# Altium schematic sheet L9963E.SchDoc
size A3; SheetNumber: 3; SheetTotal: 5
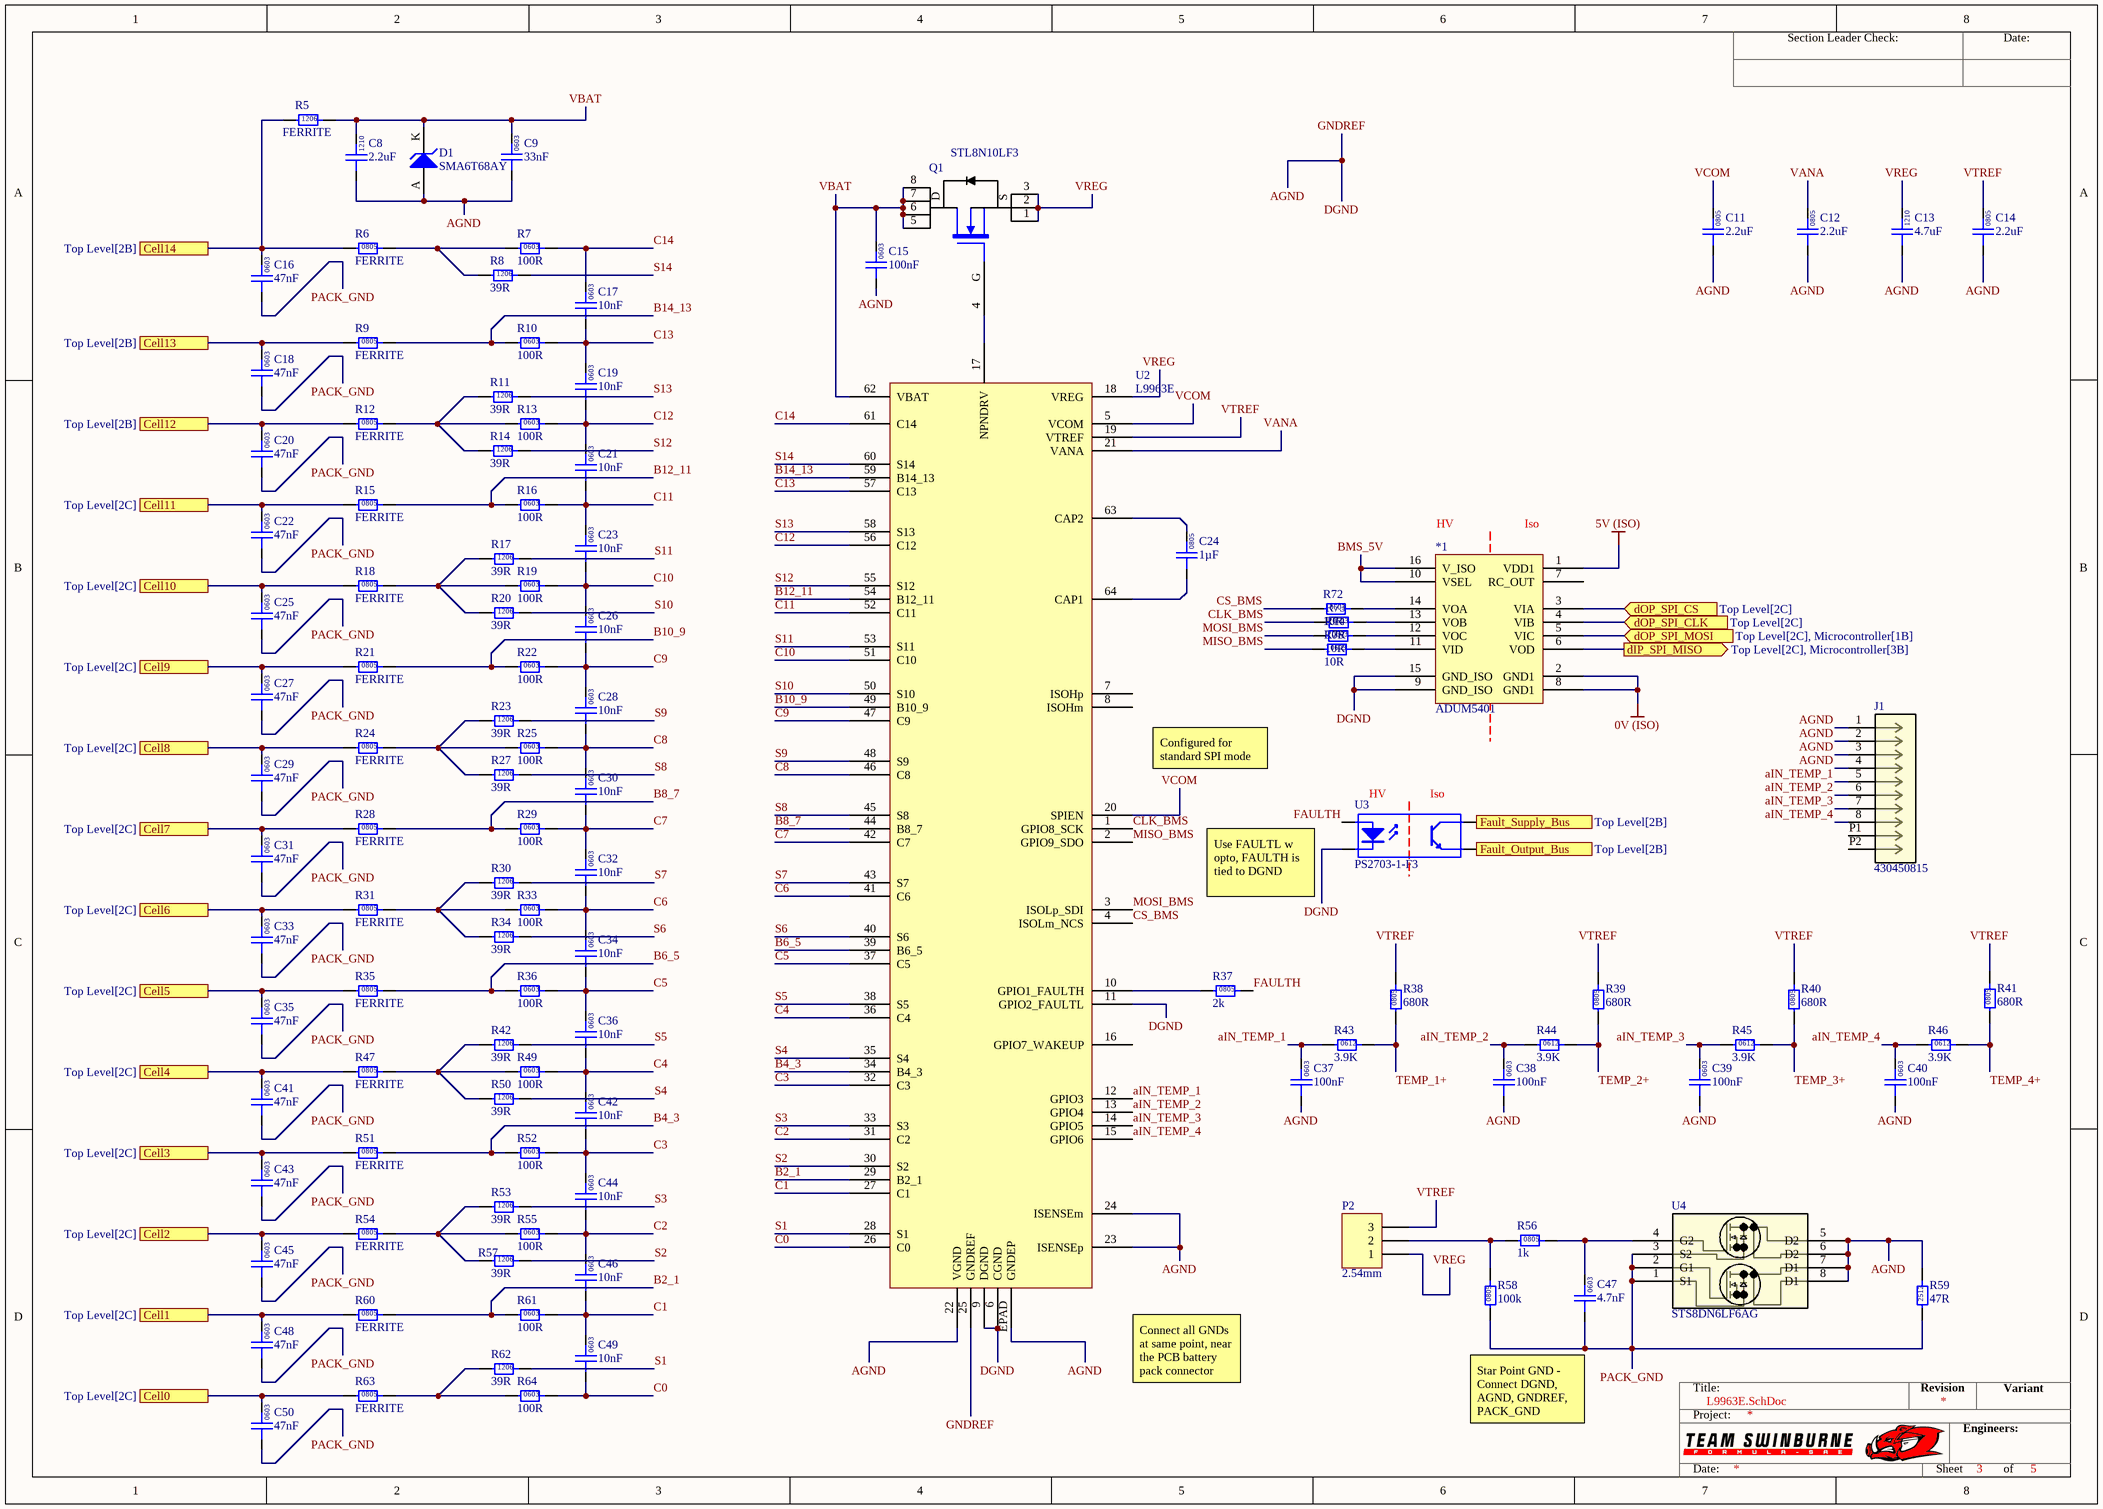
[diagram p0: L9963E.SchDoc]

## Parts
*1  ADUM5401  [AD 16-SOIC]
C8  2.2uF  [1210]
C9  33nF  [0603]
C11  2.2uF  [0805]
C12  2.2uF  [0805]
C13  4.7uF  [1210]
C14  2.2uF  [0805]
C15  100nF  [0603]
C16  47nF  [0603]
C17  10nF  [0603]
C18  47nF  [0603]
C19  10nF  [0603]
C20  47nF  [0603]
C21  10nF  [0603]
C22  47nF  [0603]
C23  10nF  [0603]
C24  1µF  [0805]
C25  47nF  [0603]
C26  10nF  [0603]
C27  47nF  [0603]
C28  10nF  [0603]
C29  47nF  [0603]
C30  10nF  [0603]
C31  47nF  [0603]
C32  10nF  [0603]
C33  47nF  [0603]
C34  10nF  [0603]
C35  47nF  [0603]
C36  10nF  [0603]
C37  100nF  [0603]
C38  100nF  [0603]
C39  100nF  [0603]
C40  100nF  [0603]
C41  47nF  [0603]
C42  10nF  [0603]
C43  47nF  [0603]
C44  10nF  [0603]
C45  47nF  [0603]
C46  10nF  [0603]
C47  4.7nF  [0603]
C48  47nF  [0603]
C49  10nF  [0603]
C50  47nF  [0603]
D1  SMA6T68AY  [ST SMB DIODE]
J1  430450815  [430450815]
P2  2.54mm  [TH 2.54mm Header 1x3]
Q1  STL8N10LF3  [TRANS_STL60P4LLF6]
R5  FERRITE  [1206]
R6  FERRITE  [0805]
R7  100R  [0603]
R8  39R  [1206]
R9  FERRITE  [0805]
R10  100R  [0603]
R11  39R  [1206]
R12  FERRITE  [0805]
R13  100R  [0603]
R14  39R  [1206]
R15  FERRITE  [0805]
R16  100R  [0603]
R17  39R  [1206]
R18  FERRITE  [0805]
R19  100R  [0603]
R20  39R  [1206]
R21  FERRITE  [0805]
R22  100R  [0603]
R23  39R  [1206]
R24  FERRITE  [0805]
R25  100R  [0603]
R27  39R  [1206]
R28  FERRITE  [0805]
R29  100R  [0603]
R30  39R  [1206]
R31  FERRITE  [0805]
R33  100R  [0603]
R34  39R  [1206]
R35  FERRITE  [0805]
R36  100R  [0603]
R37  2k  [0805]
R38  680R  [0805]
R39  680R  [0805]
R40  680R  [0805]
R41  680R  [0805]
R42  39R  [1206]
R43  3.9K  [0612]
R44  3.9K  [0612]
R45  3.9K  [0612]
R46  3.9K  [0612]
R47  FERRITE  [0805]
R49  100R  [0603]
R50  39R  [1206]
R51  FERRITE  [0805]
R52  100R  [0603]
R53  39R  [1206]
R54  FERRITE  [0805]
R55  100R  [0603]
R56  1k  [0805]
R57  39R  [1206]
R58  100k  [0805]
R59  47R  [2512]
R60  FERRITE  [0805]
R61  100R  [0603]
R62  39R  [1206]
R63  FERRITE  [0805]
R64  100R  [0603]
R72  10R  [0603]
R73  10R  [0603]
R74  10R  [0603]
R75  10R  [0603]
U2  L9963E  [TQFP64_L9963E_STM]
U3  PS2703-1-F3  [4-SOP]
U4  STS8DN6LF6AG  [SO-8_STM-M]

## Ports
Cell0 (see Top Level[2C]), Cell1 (see Top Level[2C]), Cell2 (see Top Level[2C]), Cell3 (see Top Level[2C]), Cell4 (see Top Level[2C]), Cell5 (see Top Level[2C]), Cell6 (see Top Level[2C]), Cell7 (see Top Level[2C]), Cell8 (see Top Level[2C]), Cell9 (see Top Level[2C]), Cell10 (see Top Level[2C]), Cell11 (see Top Level[2C]), Cell12 (see Top Level[2B]), Cell13 (see Top Level[2B]), Cell14 (see Top Level[2B]), dIP_SPI_MISO (out, see Top Level[2C], Microcontroller[3B]), dOP_SPI_CLK (in, see Top Level[2C]), dOP_SPI_CS (in, see Top Level[2C]), dOP_SPI_MOSI (in, see Top Level[2C], Microcontroller[1B]), Fault_Output_Bus (see Top Level[2B]), Fault_Supply_Bus (see Top Level[2B])

## Nets
0V (ISO): *1.2(GND1) *1.8(GND1)
5V (ISO): *1.1(VDD1)
AGND: *1.9(GND_ISO) *1.15(GND_ISO) C8.1 C9.1 C11.1 C12.1 C13.1 C14.1 C15.1 C37.1 C38.1 C39.1 C40.1 D1.A J1.1 J1.2 J1.3 J1.4 R59.2 U2.6(CGND) U2.9(DGND) U2.11(GPIO2_FAULTL) U2.22(VGND) U2.23(ISENSEp) U2.24(ISENSEm) U2.25(GNDREF) U2.EPAD(GNDEP) U3.2(K) U4.5(D2) U4.6(D2) U4.7(D1) U4.8(D1)  [also labelled DGND, GNDREF]
aIN_TEMP_1: C37.2 J1.5 R43.1 U2.12(GPIO3)
aIN_TEMP_2: C38.2 J1.6 R44.1 U2.13(GPIO4)
aIN_TEMP_3: C39.2 J1.7 R45.1 U2.14(GPIO5)
aIN_TEMP_4: C40.2 J1.8 R46.1 U2.15(GPIO6)
B2_1: R60.2 R61.1 U2.29(B2_1)
B4_3: R51.2 R52.1 U2.34(B4_3)
B6_5: R35.2 R36.1 U2.39(B6_5)
B8_7: R28.2 R29.1 U2.44(B8_7)
B10_9: R21.2 R22.1 U2.49(B10_9)
B12_11: R15.2 R16.1 U2.54(B12_11)
B14_13: R9.2 R10.1 U2.59(B14_13)
BMS_5V: *1.10(VSEL) *1.16(V_ISO)
C0: C49.1 R64.2 U2.26(C0)
C1: C46.1 C49.2 R61.2 U2.27(C1)
C2: C44.1 C46.2 R55.2 U2.31(C2)
C3: C42.1 C44.2 R52.2 U2.32(C3)
C4: C36.1 C42.2 R49.2 U2.36(C4)
C5: C34.1 C36.2 R36.2 U2.37(C5)
C6: C32.1 C34.2 R33.2 U2.41(C6)
C7: C30.1 C32.2 R29.2 U2.42(C7)
C8: C28.1 C30.2 R25.2 U2.46(C8)
C9: C26.1 C28.2 R22.2 U2.47(C9)
C10: C23.1 C26.2 R19.2 U2.51(C10)
C11: C21.1 C23.2 R16.2 U2.52(C11)
C12: C19.1 C21.2 R13.2 U2.56(C12)
C13: C17.1 C19.2 R10.2 U2.57(C13)
C14: C17.2 R7.2 U2.61(C14)
Cell0: C50.2 R63.1 ; port Cell0
Cell1: C48.2 R60.1 ; port Cell1
Cell2: C45.2 R54.1 ; port Cell2
Cell3: C43.2 R51.1 ; port Cell3
Cell4: C41.2 R47.1 ; port Cell4
Cell5: C35.2 R35.1 ; port Cell5
Cell6: C33.2 R31.1 ; port Cell6
Cell7: C31.2 R28.1 ; port Cell7
Cell8: C29.2 R24.1 ; port Cell8
Cell9: C27.2 R21.1 ; port Cell9
Cell10: C25.2 R18.1 ; port Cell10
Cell11: C22.2 R15.1 ; port Cell11
Cell12: C20.2 R12.1 ; port Cell12
Cell13: C18.2 R9.1 ; port Cell13
Cell14: C16.2 R5.1 R6.1 ; port Cell14
CLK_BMS: R73.1 U2.1(GPIO8_SCK)
CS_BMS: R72.1 U2.4(ISOLm_NCS)
dIP_SPI_MISO: *1.6(VOD) ; port dIP_SPI_MISO
dOP_SPI_CLK: *1.4(VIB) ; port dOP_SPI_CLK
dOP_SPI_CS: *1.3(VIA) ; port dOP_SPI_CS
dOP_SPI_MOSI: *1.5(VIC) ; port dOP_SPI_MOSI
Fault_Output_Bus: U3.3(E) ; port Fault_Output_Bus
Fault_Supply_Bus: U3.4(C) ; port Fault_Supply_Bus
FAULTH: R37.2 U3.1(A)
MISO_BMS: R75.1 U2.2(GPIO9_SDO)
MOSI_BMS: R74.1 U2.3(ISOLp_SDI)
PACK_GND: C16.1 C18.1 C20.1 C22.1 C25.1 C27.1 C29.1 C31.1 C33.1 C35.1 C41.1 C43.1 C45.1 C47.1 C48.1 C50.1 R58.1 R59.1 U4.1(S1) U4.2(G1) U4.3(S2)
S1: R62.2 U2.28(S1)
S2: R57.2 U2.30(S2)
S3: R53.2 U2.33(S3)
S4: R50.2 U2.35(S4)
S5: R42.2 U2.38(S5)
S6: R34.2 U2.40(S6)
S7: R30.2 U2.43(S7)
S8: R27.2 U2.45(S8)
S9: R23.2 U2.48(S9)
S10: R20.2 U2.50(S10)
S11: R17.2 U2.53(S11)
S12: R14.2 U2.55(S12)
S13: R11.2 U2.58(S13)
S14: R8.2 U2.60(S14)
TEMP_1+: R38.1 R43.2
TEMP_2+: R39.1 R44.2
TEMP_3+: R40.1 R45.2
TEMP_4+: R41.1 R46.2
VANA: C12.2 U2.21(VANA)
VBAT: C8.2 C9.2 C15.2 D1.K Q1.5(D) Q1.6(D) Q1.7(D) Q1.8(D) R5.2 U2.62(VBAT)
VCOM: C11.2 U2.5(VCOM) U2.20(SPIEN)
VREG: C13.2 P2.1 Q1.1(S) Q1.2(S) Q1.3(S) U2.18(VREG)
VTREF: C14.2 P2.3 R38.2 R39.2 R40.2 R41.2 U2.19(VTREF)
Net*1_11: *1.11(VID) R75.2
Net*1_12: *1.12(VOC) R74.2
Net*1_13: *1.13(VOB) R73.2
Net*1_14: *1.14(VOA) R72.2
NetC24_1: C24.1 U2.64(CAP1)
NetC24_2: C24.2 U2.63(CAP2)
NetC47_2: C47.2 R56.2 U4.4(G2)
NetP2_2: P2.2 R56.1 R58.2
NetQ1_4: Q1.4(G) U2.17(NPNDRV)
NetR6_2: R6.2 R7.1 R8.1
NetR11_1: R11.1 R12.2 R13.1 R14.1
NetR17_1: R17.1 R18.2 R19.1 R20.1
NetR23_1: R23.1 R24.2 R25.1 R27.1
NetR30_1: R30.1 R31.2 R33.1 R34.1
NetR37_1: R37.1 U2.10(GPIO1_FAULTH)
NetR42_1: R42.1 R47.2 R49.1 R50.1
NetR53_1: R53.1 R54.2 R55.1 R57.1
NetR62_1: R62.1 R63.2 R64.1

Not connected (* = marked no-connect by the designer): *1 7(RC_OUT); J1 P1 P2; U2 7(ISOHp) 8(ISOHm) 16(GPIO7_WAKEUP)

## Notes on the sheet
- (near *1) HV
- (near *1) Iso
- Configured for standard SPI mode
- (near U3) HV
- (near U3) Iso
- (near U3) Use FAULTL w opto, FAULTH is tied to DGND
- (near U2) Connect all GNDs at same point, near the PCB battery pack connector
- Star Point GND - Connect DGND, AGND, GNDREF, PACK_GND
- Section Leader Check:
- Date:
- Title:
- Revision
- Variant
- Project:
- Engineers:
- Sheet
- of
- (in symbol 3430B2F3K9TDF) 0612
- (in symbol BLM31KN102SH1L) 1206
- (in symbol C1210X475K101T) 1210
- (in symbol CGA3E2X7R2A472K080AA) 0603
- (in symbol CL10B104KC8NNNC) 0603
- (in symbol CL10B333KC8WPNC) 0603
- (in symbol CL32B225KCJSNNE) 1210
- (in symbol CRCW120639R0FKEAHP) 1206
- (in symbol CRCW251247R0FKEG) 2512
- (in symbol GCJ188R92A473KA01D) 0603
- (in symbol GCM21BR71H105KA03L) 0805
- (in symbol GCM188L81H103KA03D) 0603
- (in symbol GRM21BR71E225KE11L) 0805
- (in symbol MPZ2012S102ATD25) 0805
- (in symbol RC0603FR-0710RL) 0603
- (in symbol RC0805FR071KL) 0805
- (in symbol RC0805FR072KL) 0805
- (in symbol RC0805FR07100KL) 0805
- (in symbol RCS0805680RFKEA) 0805

## Library data of the parts
*1 = ADUM5401: Quad Channel 2.5kV Digital Isolator with isoPower; Manufacturer: Analogue Devices; Complex IC: 0; Part Number: ADUM5401
C8 = CL32B225KCJSNNE: Manufacturer: Samsung Electro-Mechanics; Rated Voltage: 100V; Tolerance: ±10%; Material: MLCC; Temperature Rating: X7R; Part Number: CL32B225KCJSNNE; Value: 2.2uF; Digikey Part Number: 1276-3362-6-ND
C9 = CL10B333KC8WPNC: Manufacturer: Samsung Electro-Mechanics; Rated Voltage: 100V; Tolerance: ±10%; Material: MLCC; Temperature Rating: X7R; Part Number: CL10B333KC8WPNC; Value: 33nF; Digikey Part Number: 1276-CL10B333KC8WPNCDKR-ND
C11 C12 C14 = GRM21BR71E225KE11L: Manufacturer: Murata Electronics; Rated Voltage: 25V; Tolerance: ±10%; Material: MLCC; Temperature Rating: X7R; Part Number: GRM21BR71E225KE11L; Value: 2.2uF; Digikey Part Number: 490-14467-2-ND
C13 = C1210X475K101T: Manufacturer: Holy Stone Enterprise Co., Ltd.; Rated Voltage: 100V; Tolerance: ±10%; Material: MLCC; Temperature Rating: X7R; Part Number: C1210X475K101T; Value: 4.7uF; Digikey Part Number: 4587-C1210X475K101TDKR-ND
C15 C37-C40 = CL10B104KC8NNNC: Manufacturer: Samsung Electro-Mechanics; Rated Voltage: 100V; Tolerance: ±10%; Material: MLCC; Temperature Rating: X7R; Part Number: CL10B104KC8NNNC; Value: 100nF; Digikey Part Number: 1276-6807-6-ND
C16 C18 C20 C22 C25 C27 C29 C31 C33 C35 C41 C43 C45 C48 C50 = GCJ188R92A473KA01D: Manufacturer: Murata Electronics; Rated Voltage: 100V; Tolerance: ±10%; Material: MLCC; Temperature Rating: X8R; Part Number: GCJ188R92A473KA01D; Value: 47nF; Digikey Part Number: 490-16473-1-ND
C17 C19 C21 C23 C26 C28 C30 C32 C34 C36 C42 C44 C46 C49 = GCM188L81H103KA03D: Manufacturer: muRata; Rated Voltage: 50V; Tolerance: ±10%; Material: MLCC; Temperature Rating: X8L; Part Number: GCM188L81H103KA03D; Value: 10nF; Digikey Part Number: 490-GCM188L81H103KA03DCT-ND
C24 = GCM21BR71H105KA03L: Manufacturer: muRata; Rated Voltage: 50V; Tolerance: ±10%; Material: MLCC; Temperature Rating: X7R; Part Number: GCM21BR71H105KA03L; Value: 1µF; Digikey Part Number: 490-10675-1-ND
C47 = CGA3E2X7R2A472K080AA: Manufacturer: TDK Corporation; Rated Voltage: 100V; Tolerance: ±10%; Material: MLCC; Temperature Rating: X7R; Part Number: CGA3E2X7R2A472K080AA; Value: 4.7nF; Digikey Part Number: 445-5810-6-ND
D1 = SMA6T68AY: Manufacturer: STMicroelectronics; Breakdown Voltage: 121V; Rated Power: 600W; Part Number: SMA6T68AY
J1 = 430450815: No Description Available; Mfr_Name: Molex Connector Corporation; Positions: 8; Pitch: 3.0mm; Angle: 90; Contact: Gold; RefDes: RefDes; Type: Type; Part Number: 430450815; Row Spacing: 3.0mm; Flange: No; Digikey Part Number: WM7067DKR-ND; Digikey Link: https://www.digikey.com/en/products/detail/molex/0430450815/3044333
P2 = TH 2.54mm Header 1x3: Positions: 3; Angle: 0; Flange: No; Contact: NA; Part Number: TH 2.54mm Header 1x3; Pitch: 2.54mm; Row Spacing: 2.54mm
Q1 = STL8N10LF3: N-Channel 100 V 20A (Tc) 4.3W (Ta), 70W (Tc) Surface Mount PowerFlat™ (5x6); Manufacturer: STMicroelectronics; Published: 24-Mar-1999; LatestRevisionDate: 29-May-2009; LatestRevisionNote: IPC-7351 Footprint Added.; PackageVersion: Sep-2000; PackageReference: SOT-343; Publisher: Altium Limited; PackageDescription: 4-Pin SOT-343 Package 1.3 mm Pitch, 2.1 mm Lead Span; Part Number: STL8N10LF3; Type: N-channel; Rated Power: 70W; Digikey Part Number: 497-13652-6-ND
R5 = BLM31KN102SH1L: Manufacturer: Murata Electronics; Value: 1K; Part Number: BLM31KN102SH1L; Rated Power: Ferrite; Digikey Part Number: 490-16520-6-ND
R6 R9 R12 R15 R18 R21 R24 R28 R31 R35 R47 R51 R54 R60 R63 = MPZ2012S102ATD25: Manufacturer: TDK; Value: 1K; Part Number: MPZ2012S102ATD25; Rated Power: Ferrite
R7 R10 R13 R16 R19 R22 R25 R29 R33 R36 R49 R52 R55 R61 R64 = RC0603FR-0710RL: Manufacturer: YAGEO; Value: 10R; Tolerance: 0.01; Rated Power: 0.1W; Part Number: RC0603FR-0710RL; Material: FR-07; Digikey Part Number: 311-10.0HRCT-ND
R8 R11 R14 R17 R20 R23 R27 R30 R34 R42 R50 R53 R57 R62 = CRCW120639R0FKEAHP: Manufacturer: Vishay Dale; Tolerance: 0.01; Rated Power: 0.75W; Part Number: CRCW120639R0FKEAHP; Value: 39R; Digikey Part Number: 541-39.0UCT-ND
R37 = RC0805FR072KL: Manufacturer: YAGEO; Tolerance: 0.01; Rated Power: 0.125W; Part Number: RC0805FR072KL; Value: 2k; Material: FR-07; Digikey Part Number: 311-2.00KCRCT-ND
R38-R41 = RCS0805680RFKEA: Manufacturer: Vishay Dale; Tolerance: 0.01; Rated Power: 0.5; Part Number: RCS0805680RFKEA; Value: 680R; Material: Thick Film; Digikey Part Number: 541-10548-6-ND
R43-R46 = 3430B2F3K9TDF: Manufacturer: TE Connectivity Passive Product; Tolerance: 0.01; Rated Power: 1.5W; Part Number: 3430B2F3K9TDF; Value: 3.9K; Material: Thick Film; Digikey Part Number: 1712-3430B2F3K9TDFDKR-ND
R56 = RC0805FR071KL: Manufacturer: YAGEO; Tolerance: 0.01; Rated Power: 0.125W; Part Number: RC0805FR071KL; Value: 1k; Material: FR-07; Digikey Part Number: 311-1.00KCRCT-ND
R58 = RC0805FR07100KL: Manufacturer: YAGEO; Tolerance: 0.01; Rated Power: 0.125W; Part Number: RC0805FR07100KL; Value: 100k; Material: FR-07; Digikey Part Number: 311-100KCRCT-ND
R59 = CRCW251247R0FKEG: Manufacturer: Vishay Dale; Tolerance: 0.01; Rated Power: 1W; Part Number: CRCW251247R0FKEG; Value: 47R; Material: Thick Film; Digikey Part Number: 541-47.0AFDKR-ND
R72-R75 = RC0603FR-0710RL: Manufacturer: YAGEO; Tolerance: 0.01; Rated Power: 0.1W; Part Number: RC0603FR-0710RL; Value: 10R; Material: FR-07; Digikey Part Number: 311-10.0HRCT-ND
U2 = L9963E: AUTOMOTIVE CHIP FOR BATTERY MANA; Manufacturer: ST Microelectronics; Complex IC: 1; Part Number: L9963E
U3 = PS2703-1-F3: OPTOISOLATOR 3.75KV TRANS 4SMD; Manufacturer: Renesas Electronics Corporation; Complex IC: 0; Part Number: PS2703-1-F3; Digikey Part Number: 559-1155-6-ND; Digikey Link: https://www.digikey.com.au/en/products/detail/renesas-electronics-corporation/PS2703-1-F3-A/9564816
U4 = STS8DN6LF6AG: Mosfet Array 60V 8A (Ta) 3.2W Surface Mount 8-SO; Mfr_Name: STMicroelectronics; Complex IC: 0; RefDes: RefDes; Type: Type; Part Number: STS8DN6LF6AG; Manufacturer: STMicroelectronics; Digikey Part Number: 497-17309-6-ND; Digikey Link: https://www.digikey.com.au/en/products/detail/stmicro/STS8DN6LF6AG/7360928?utm_adgroup=&utm_source=google&utm_medium=cpc&utm_campaign=PMax%20Shopping_Low%20Performing%20Products&utm_term=&utm_id=go_cmp-20086482685_adg-_ad-__dev-c_ext-_prd-_sig-Cj0KCQjw-5y